# EasyEDA schematic VCO_4046 with low pass filter.json
TITLE: 4046 VCO v1; REV: 1.0; Date: 2020-12-31; Sheet: 1/1; Company: Your Company
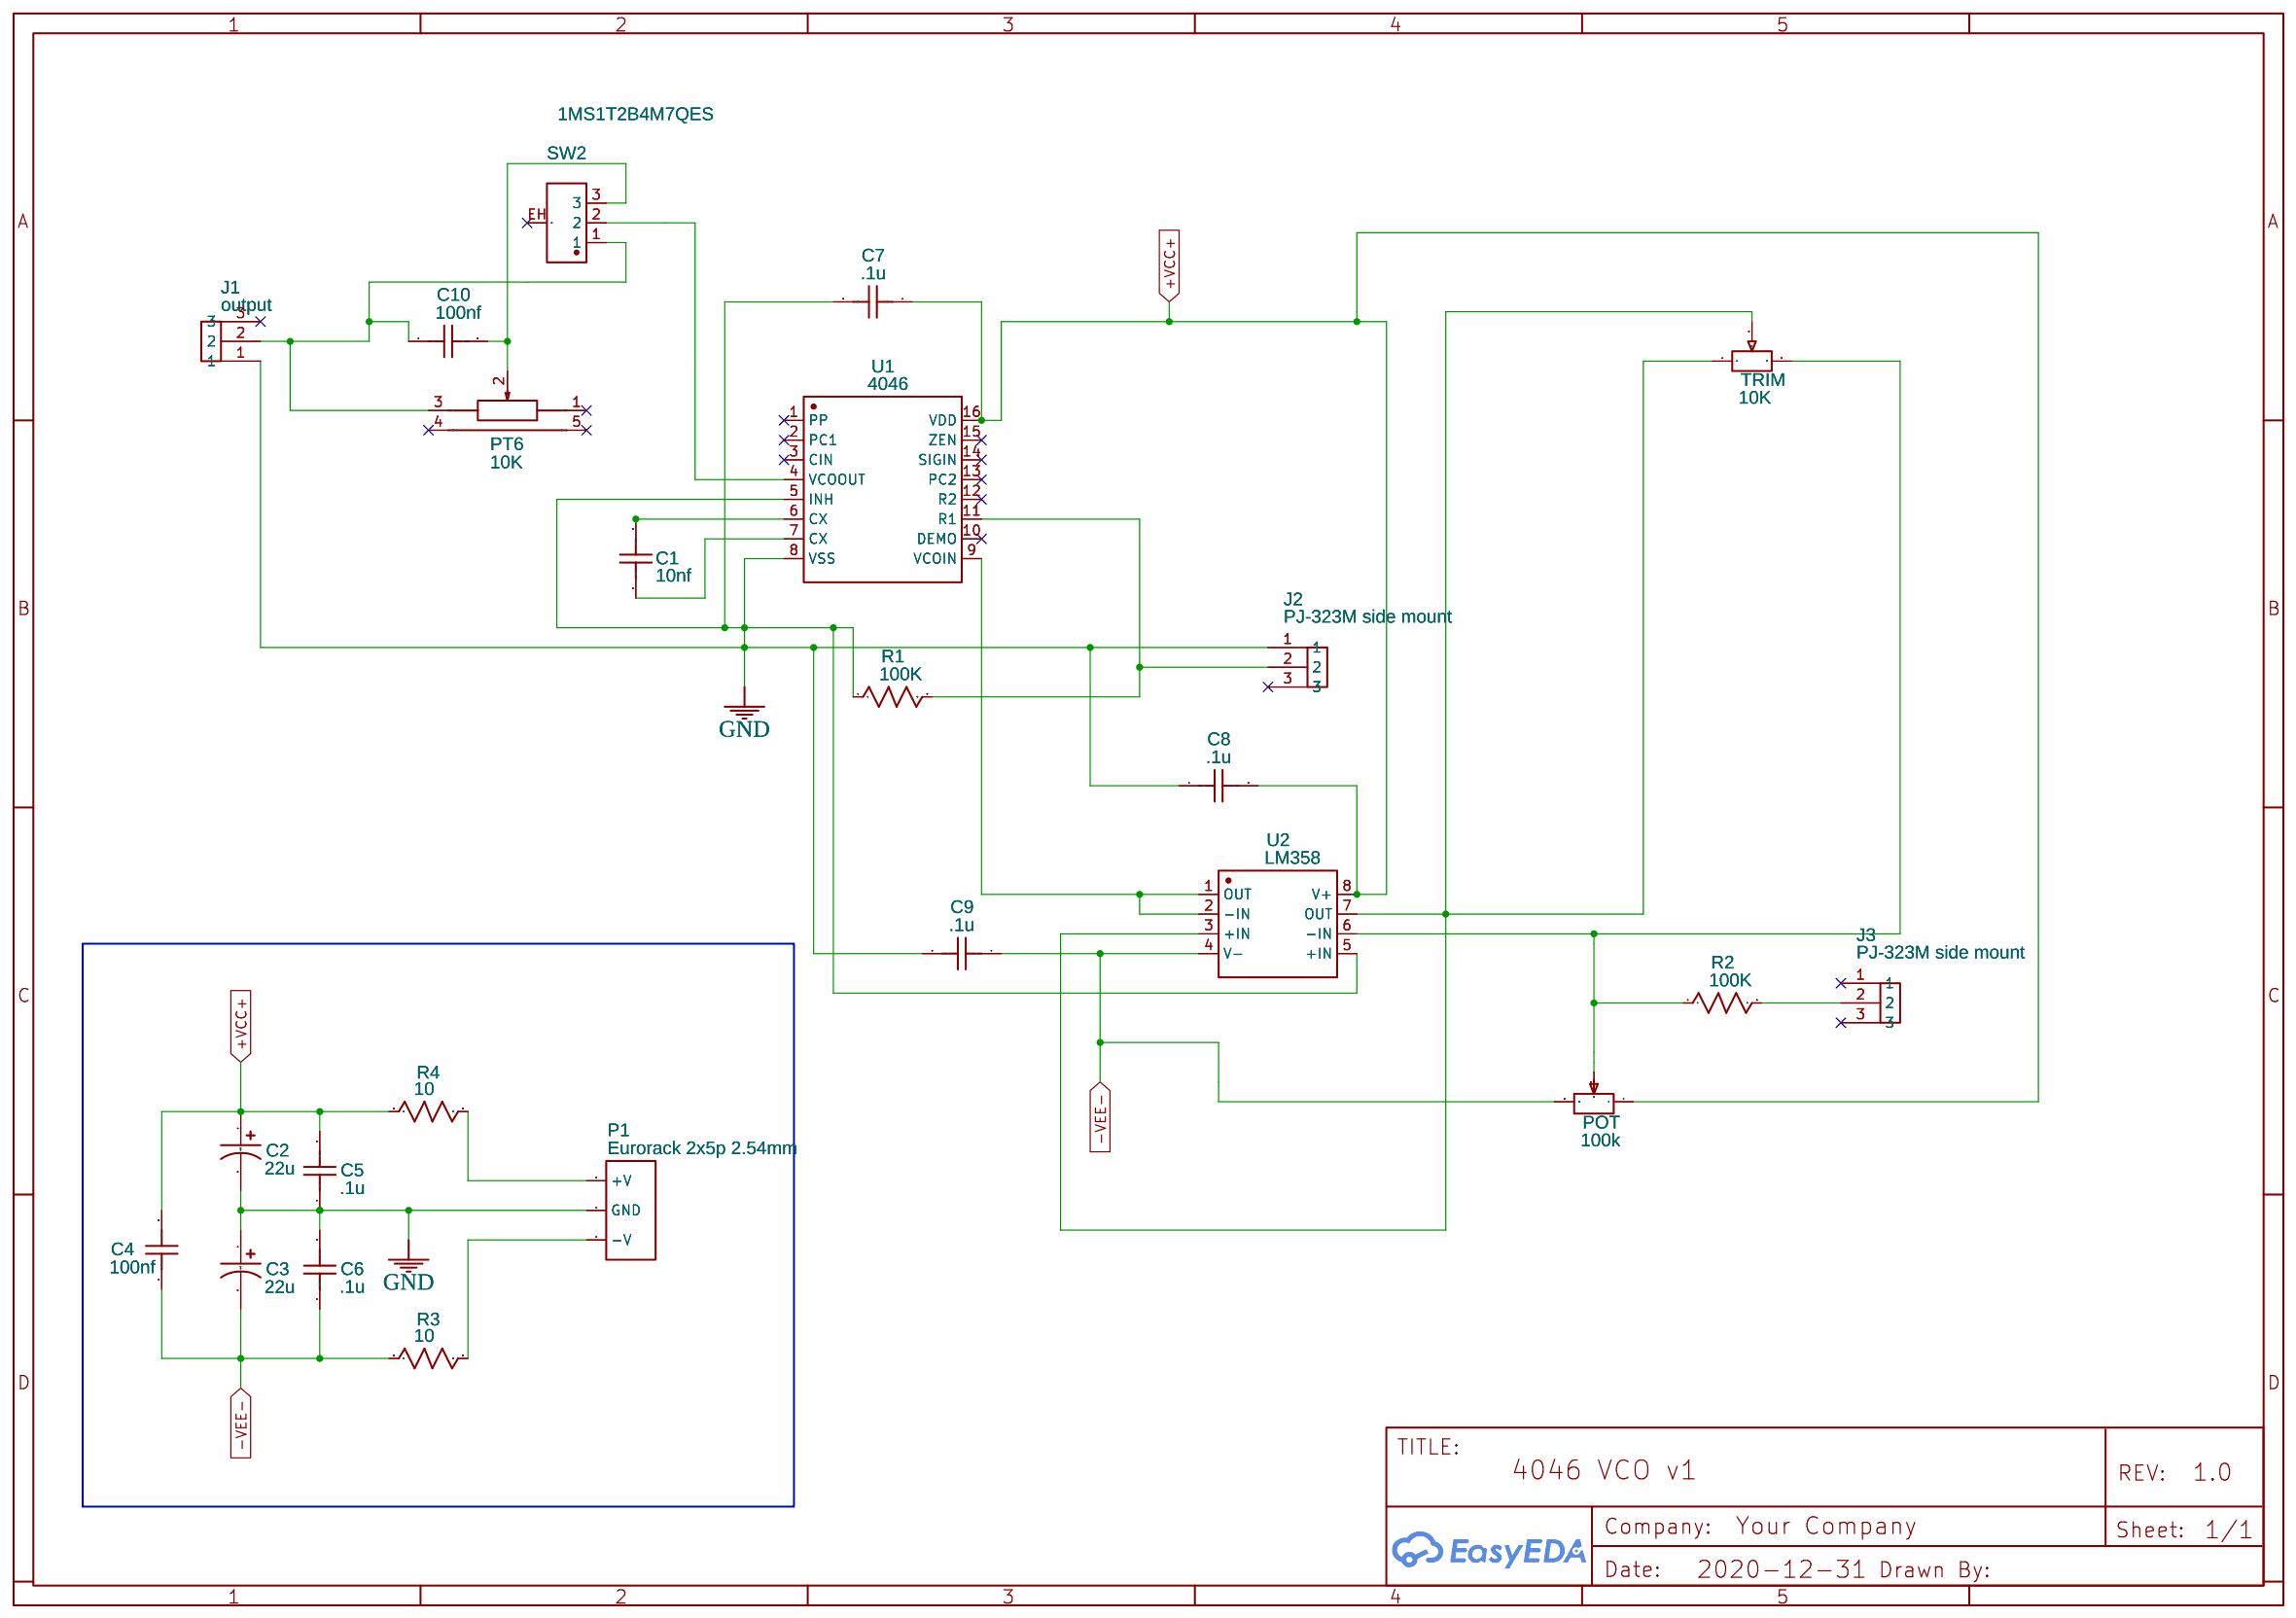
[diagram p0: schematic sheet]

## Parts
C1  10nf  [RAD-0.1]
C2  22u  [CAP-D5.0×F2.0]
C3  22u  [CAP-D5.0×F2.0]
C4  100nf  [RAD-0.1]
C5  .1u  [RAD-0.1]
C6  .1u  [RAD-0.1]
C7  .1u  [RAD-0.1]
C8  .1u  [RAD-0.1]
C9  .1u  [RAD-0.1]
C10  100nf  [RAD-0.1]
J1  output  [PJ-323M SIDE MOUNT]
J2  PJ-323M side mount  [PJ-323M SIDE MOUNT]
J3  PJ-323M side mount  [PJ-323M SIDE MOUNT]
P1  Eurorack 2x5p 2.54mm  [EURORACK HDR-IDC-2.54-2X5P]
POT  100k  [RES-ADJ-TH_RK1631110U1Q]
PT6  10K  [RES-TH_RK09K1110A0J]
R1  100K  [R_AXIAL-0.5]
R2  100K  [R_AXIAL-0.5]
R3  10  [R_AXIAL-0.5]
R4  10  [R_AXIAL-0.5]
SW2  1MS1T2B4M7QES  [SW-TH_1MS1T2B4M7QES]
TRIM  10K  [RES-ADJ-TH_3P-L9.5-W9.5-P2.50-L_3386P]
U1  4046  [DIP16]
U2  LM358  [DIP8]

## Library data of the parts
C1 C4-C10 = C_RAD-0.1_US: Contributor: LCEDA_Lib
C2 C3 = CE_TH_D5.0×F2.0_US: Contributor: LCEDA_Lib
J1-J3 = PJ-323M side mount: Manufacturer: Tayda; Manufacturer Part: PJ-323M; Supplier: Mouser; Supplier Part: PJ-323M; Contributor: unfirth
P1 = Eurorack 2x5p 2.54mm: Supplier: LCSC; Manufacturer: BOOMELE; Manufacturer Part: IDC Box 2.54mm 2X5P; image: //image.lceda.cn/szlcsc/C5665.jpg; Supplier Part: C5665; Contributor: kalymnos77
POT = RK1631110U1Q: Supplier: LCSC; Supplier Part: C370978; Manufacturer: ALPS Electric; Manufacturer Part: PTV09A-2020F-B103; Contributor: LCSC
PT6 = RK09K1110A0J: Supplier: LCSC; Supplier Part: C209767; Manufacturer: ALPS Electric; Contributor: LCSC
R1-R4 = R_AXIAL-0.5_US: Contributor: LCEDA_Lib
SW2 = 1MS1T2B4M7QES: Supplier: LCSC; Supplier Part: C496157; Manufacturer: Dailywell; Contributor: LCSC
TRIM = 3386P-1-103_C118953: Supplier: LCSC; Supplier Part: C118953; Manufacturer: Chengdu Guosheng Tech; Manufacturer Part: 3386P-1-103; Contributor: LCSC
U1 = 4046
U2 = LM358

## Nets
+VCC+: C2.1 C4.2 C5.2 C7.1 C8.2 POT.1 R4.1 U1.16(VDD) U2.8(V+)
-VEE-: C3.2 C4.1 C6.1 C9.1 POT.3 R3.1 U2.4(V-)
GND: C2.2 C3.1 C5.1 C6.2 C7.2 C8.1 C9.2 J1.1 J2.1 P1.2(GND) R1.1 U1.5(INH) U1.8(VSS) U2.5(+IN)
Net-(C1-1): C1.1 U1.7(CX)
Net-(C1-2): C1.2 U1.6(CX)
Net-(C10-1): C10.1 J1.2 PT6.3 SW2.1
Net-(C10-2): C10.2 PT6.2 SW2.3
Net-(J2-2): J2.2 R1.2 U1.11(R1)
Net-(J3-2): J3.2 R2.2
Net-(P1-1): P1.1(-V) R3.2
Net-(P1-3): P1.3(+V) R4.2
Net-(POT-2): POT.2 R2.1 TRIM.3 U2.6(-IN)
Net-(SW2-2): SW2.2 U1.4(VCOOUT)
Net-(TRIM-1): TRIM.1 TRIM.2 U2.3(+IN) U2.7(OUT)
Net-(U1-9): U1.9(VCOIN) U2.1(OUT) U2.2(-IN)

Not connected (* = marked no-connect by the designer): J1 3*; J2 3*; J3 1* 3*; PT6 1* 4(EH)* 5(EH)*; SW2 EH*; U1 1(PP)* 2(PC1)* 3(CIN)* 10(DEMO)* 12(R2)* 13(PC2)* 14(SIGIN)* 15(ZEN)*
